# Altium schematic sheet Receiver Internal Wiring.SchDoc
size 381 x 241 mm; DocumentNumber: 1A21J11_J2; Document Name: Receiver Internal Wiring
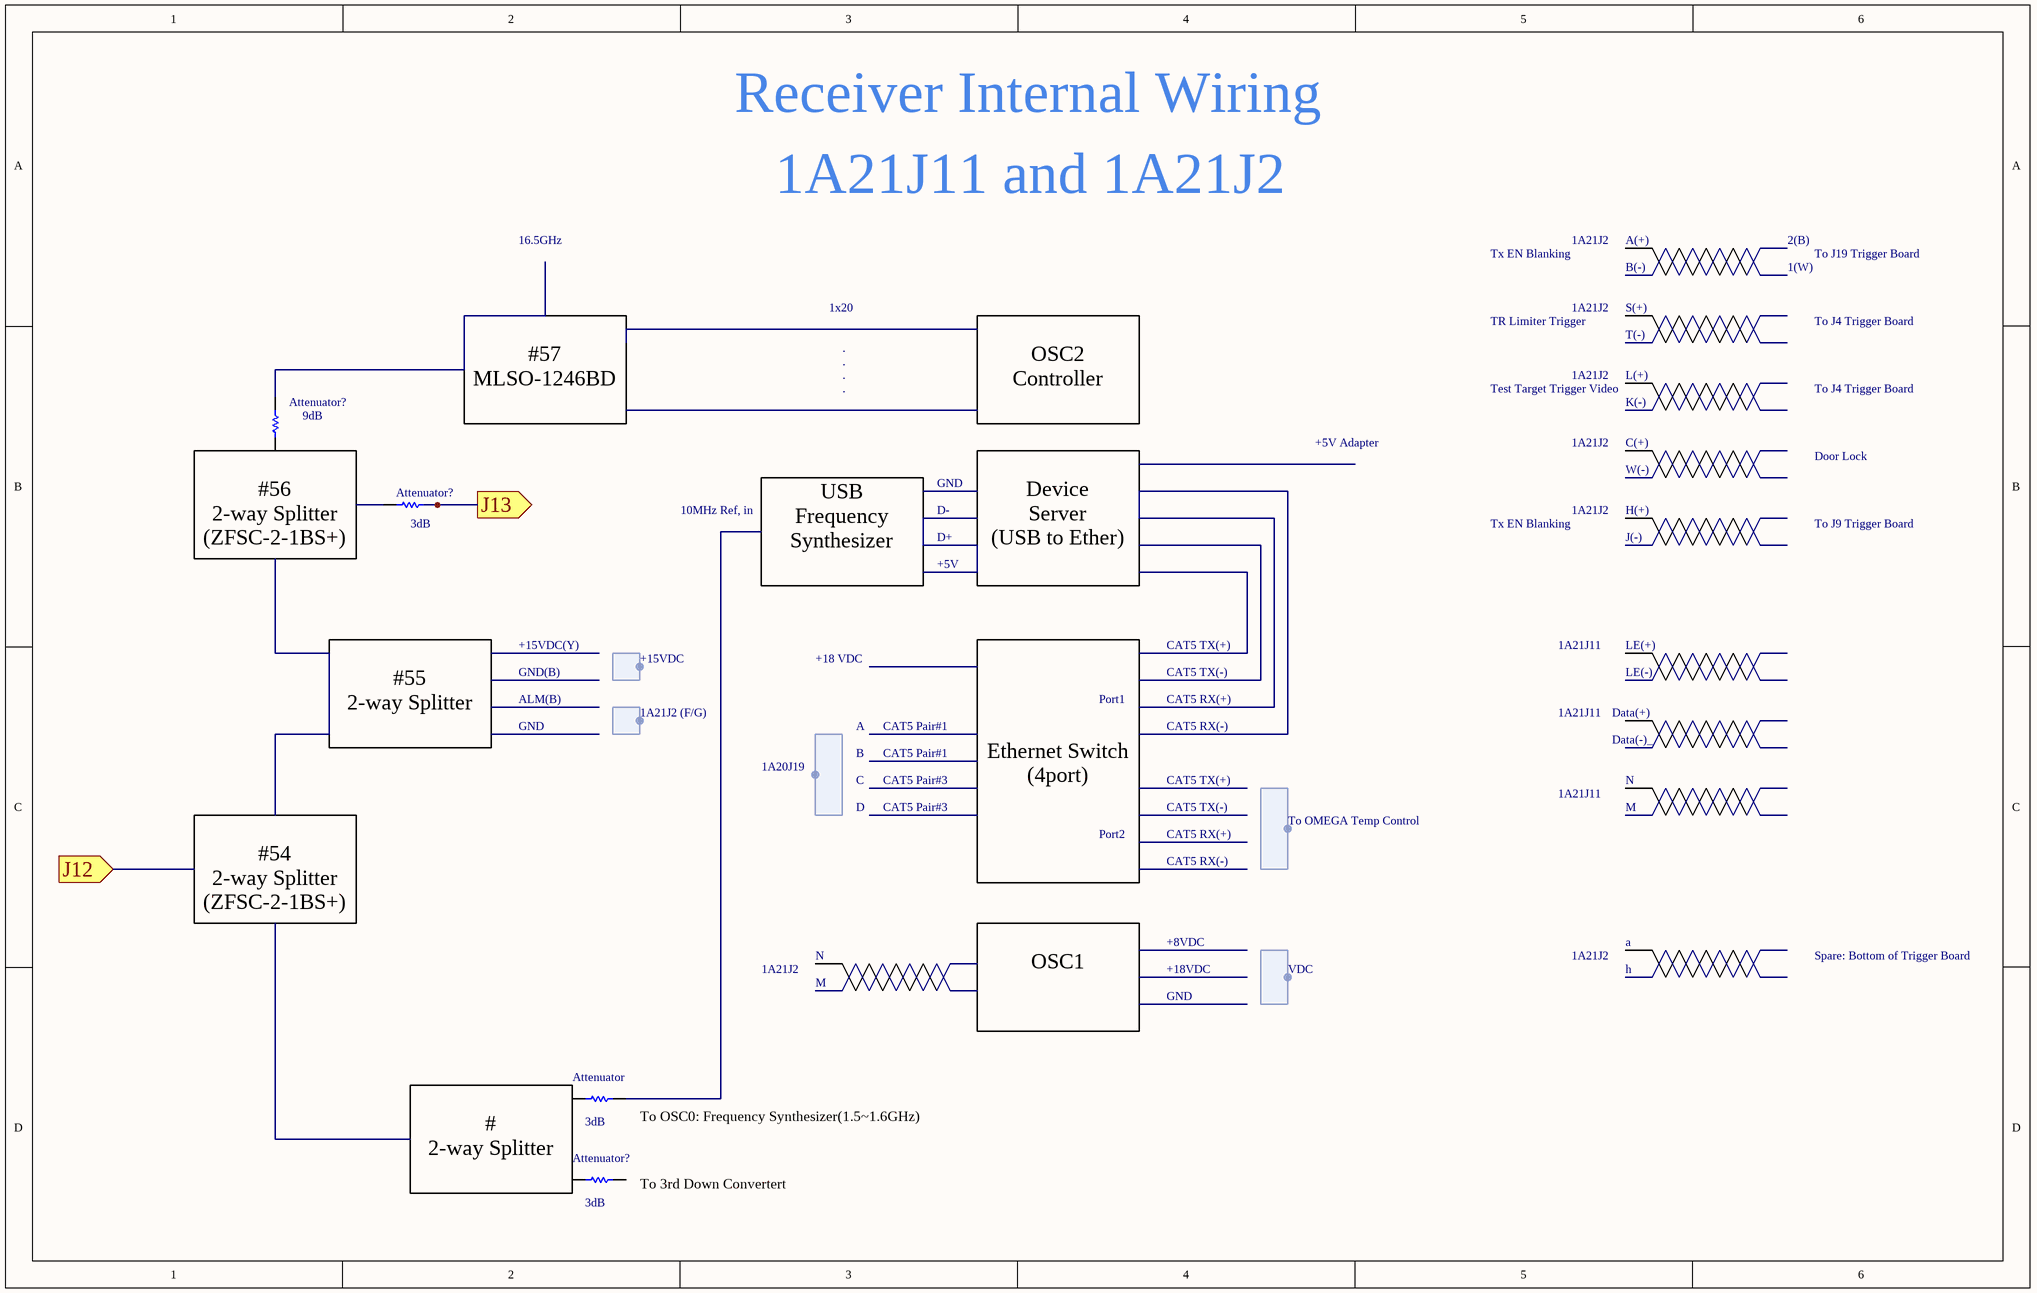
[diagram p0: Receiver Internal Wiring.SchDoc]

## Parts
(Parts that share a designator on the sheet are numbered #1, #2 ... from top to bottom, then left to right.)
Attenuator  value 3dB  [AXIAL-0.3]  (hidden comment: Res1)
Attenuator?#1  value 9dB  [AXIAL-0.3]  (hidden comment: Res1)
Attenuator?#2  value 3dB  [AXIAL-0.3]  (hidden comment: Res1)
Attenuator?#3  value 3dB  [AXIAL-0.3]  (hidden comment: Res1)

## Ports
J12 (in), J13 (out)

## Harnesses
+15VDC: 
1A21J2 (F/G): 
VDC: 
1A20J19: 
To OMEGA Temp Control: 

## Nets
J13: Attenuator?#2.2 ; port J13

Not connected (* = marked no-connect by the designer): Attenuator 1 2; Attenuator?#1 1 2; Attenuator?#2 1; Attenuator?#3 1 2

## Notes on the sheet
- 1A21J11 and 1A21J2
- 16.5GHz
- Tx EN Blanking
- 1A21J2
- B(-)
- A(+)
- 1(W)
- 2(B)
- To J19 Trigger Board
- 1x20
- .
- TR Limiter Trigger
- T(-)
- S(+)
- To J4 Trigger Board
- #57
  MLSO-1246BD
- OSC2
  Controller
- Test Target Trigger Video
- K(-)
- L(+)
- GND
- +5V Adapter
- W(-)
- C(+)
- Door Lock
- (near Attenuator?#1) #56
  2-way Splitter
  (ZFSC-2-1BS+)
- 10MHz Ref, in
- D-
- D+
- +5V
- J(-)
- H(+)
- To J9 Trigger Board
- USB
  Frequency
  Synthesizer
- Device
  Server
  (USB to Ether)
- +15VDC(Y)
- GND(B)
- ALM(B)
- +18 VDC
- Port1
- CAT5 TX(+)
- CAT5 TX(-)
- CAT5 RX(+)
- 1A21J11
- LE(-)
- LE(+)
- #55
  2-way Splitter
- A
- B
- CAT5 Pair#1
- CAT5 RX(-)
- Data(-)_
- Data(+)
- C
- D
- CAT5 Pair#3
- Port2
- M
- N
- Ethernet Switch
  (4port)
- #54
  2-way Splitter
  (ZFSC-2-1BS+)
- +8VDC
- +18VDC
- h
- a
- Spare: Bottom of Trigger Board
- OSC1
- (near Attenuator) To OSC0: Frequency Synthesizer(1.5~1.6GHz)
- #
  2-way Splitter
- (near Attenuator?#3) To 3rd Down Convertert

## Library data of the parts
Attenuator Attenuator?#1-Attenuator?#3 = Res1: Attenuator; Published: 8-Jun-2000; LatestRevisionDate: 17-Jul-2002; LatestRevisionNote: Re-released for DXP Platform.; PackageReference: AXIAL-0.3; Publisher: Altium Limited; PackageDescription: Axial Device, Thru-Hole; 2 Leads; 0.3 in Pin Spacing